# Altium project ESC.PrjPcb
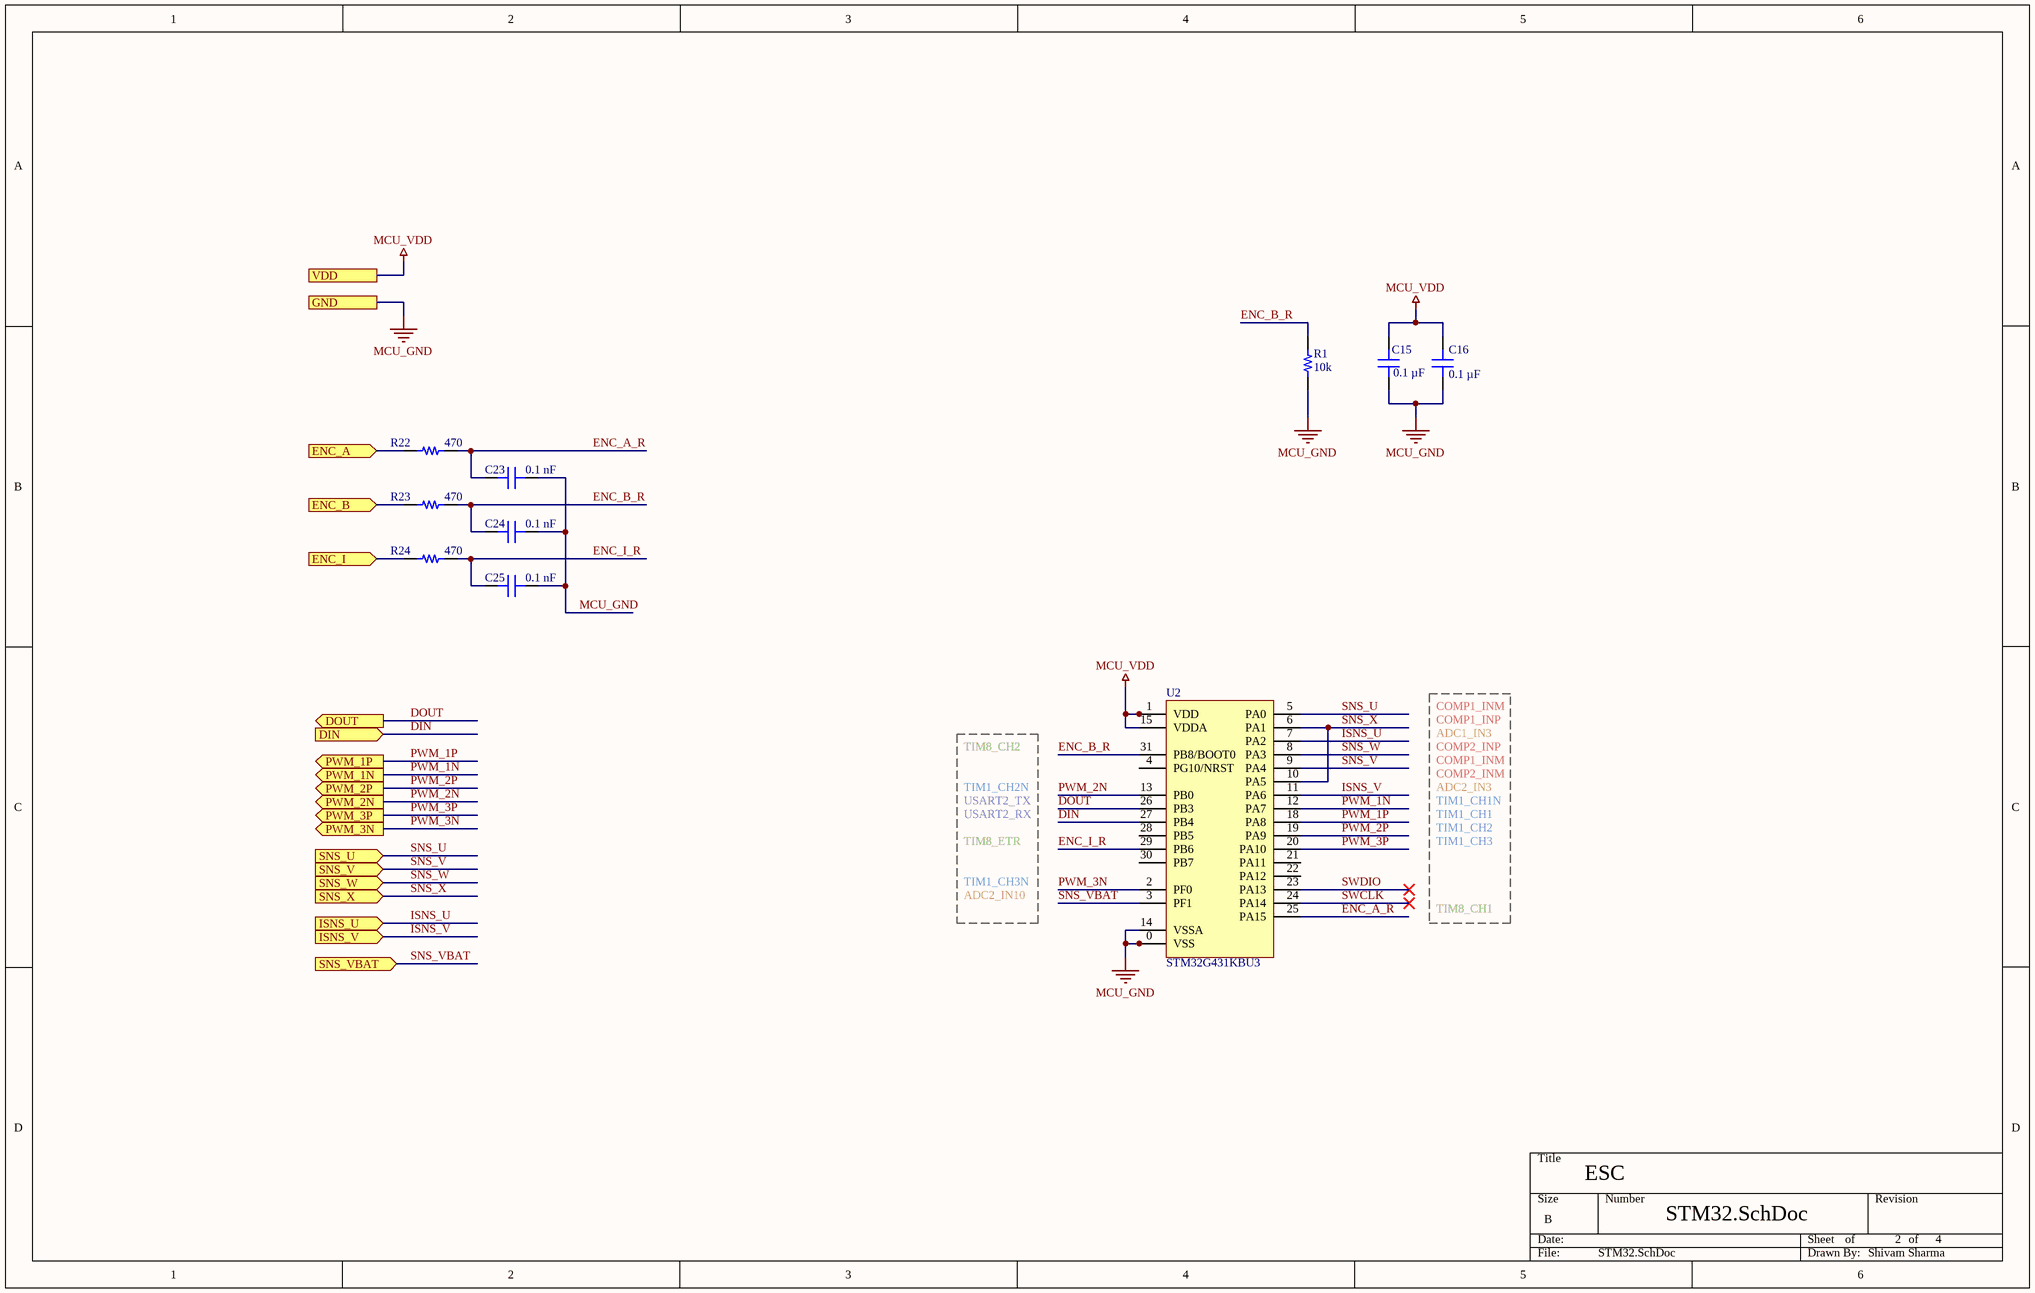
[diagram p0: STM32.SchDoc]
DrawnBy: Shivam Sharma; Project: ESC; Revision: 1.0
2 sheets, 14 parts. Net scope: strictly hierarchical (ports join the sheet entries above them; power ports are local).
Board file: ESC.PcbDoc
Sheets:
  STM32.SchDoc
  3V3_LDO.SchDoc

## Sheet STM32.SchDoc
size B; SheetNumber: 2; SheetTotal: 4

### Parts
C15  0.1 µF  [CAP 0402_1005]
C16  0.1 µF  [CAP 0402_1005]
C23  0.1 nF  [CAP 0402_1005]
C24  0.1 nF  [CAP 0402_1005]
C25  0.1 nF  [CAP 0402_1005]
R1  10k  [RES 0402_1005]
R22  470  [RES 0402_1005]
R23  470  [RES 0402_1005]
R24  470  [RES 0402_1005]
U2  STM32G431KBU3  [QFN50P400X400X60-32N]

### Ports
DIN (in), DOUT (out), ENC_A (in), ENC_B (in), ENC_I (in), GND, ISNS_U (in), ISNS_V (in), PWM_1N (out), PWM_1P (out), PWM_2N (out), PWM_2P (out), PWM_3N (out), PWM_3P (out), SNS_U (in), SNS_V (in), SNS_VBAT (in), SNS_W (in), SNS_X (in), VDD

### Nets
MCU_GND: C15.1 C16.1 C23.2 C24.2 C25.2 R1.1 U2.0(VSS) U2.14(VSSA) U2.16(VSS) U2.32(VSS) ; port GND
MCU_VDD: C15.2 C16.2 U2.1(VDD) U2.15(VDDA) U2.17(VDD) ; port VDD
DIN: U2.27(PB4) ; port DIN
DOUT: U2.26(PB3) ; port DOUT
ENC_A: R22.1 ; port ENC_A
ENC_A_R: C23.1 R22.2 U2.25(PA15)
ENC_B: R23.1 ; port ENC_B
ENC_B_R: C24.1 R1.2 R23.2 U2.31(PB8/BOOT0)
ENC_I: R24.1 ; port ENC_I
ENC_I_R: C25.1 R24.2 U2.29(PB6)
ISNS_U: U2.7(PA2) ; port ISNS_U
ISNS_V: U2.11(PA6) ; port ISNS_V
PWM_1N: U2.12(PA7) ; port PWM_1N
PWM_1P: U2.18(PA8) ; port PWM_1P
PWM_2N: U2.13(PB0) ; port PWM_2N
PWM_2P: U2.19(PA9) ; port PWM_2P
PWM_3N: U2.2(PF0) ; port PWM_3N
PWM_3P: U2.20(PA10) ; port PWM_3P
SNS_U: U2.5(PA0) ; port SNS_U
SNS_V: U2.9(PA4) ; port SNS_V
SNS_VBAT: U2.3(PF1) ; port SNS_VBAT
SNS_W: U2.8(PA3) ; port SNS_W
SNS_X: U2.6(PA1) U2.10(PA5) ; port SNS_X
SWCLK: U2.24(PA14)
SWDIO: U2.23(PA13)

Not connected (* = marked no-connect by the designer): U2 4(PG10/NRST) 21(PA11) 22(PA12) 28(PB5) 30(PB7)

### Notes on the sheet
- TIM8_CH2
- COMP1_INM
- COMP1_INP
- ADC1_IN3
- COMP2_INP
- COMP2_INM
- TIM1_CH2N
- USART2_TX
- USART2_RX
- ADC2_IN3
- TIM1_CH1N
- TIM1_CH1
- TIM1_CH2
- TIM1_CH3N
- TIM8_ETR
- ADC2_IN10
- TIM1_CH3
- TIM8_CH1
- of

### Library data of the parts
C15 C16 = C0402C104K4RACAUTO: CAP CER 0.1UF 16V X7R 0402; manufacturer: KEMET; Tolerance: ±10%; Part Number: C0402C104K4RACAUTO; Value: 0.1 µF; Applications: Automotive, Bypass, Decoupling; Capacitance: 0.1 µF; componentlink1description: Datasheet; componentlink1url: https://api.kemet.com/component-edge/download/specsheet/C0402C104K4RACAUTO.pdf; componentlink2description: DigiKey Link; componentlink2url: https://www.digikey.com/en/products/detail/kemet/C0402C104K4RACAUTO/3314827; Device Package: 0402 (1005 Metric); lastupdated: 8/14/2022 9:05:51 PM; Lifecycle Status: Active; Minimum Order: 1; Mounting Type: Surface Mount, MLCC; Operating Temperature: -55°C ~ 125°C; Package / Case: 0402 (1005 Metric); packaging: TapeAndReel; partid: 3024; Part Status: Active; price: 0.01; Ratings: AEC-Q200; series: SMD Auto X7R; Size / Dimension: 0.039" L x 0.020" W (1.00mm x 0.50mm); Supplier 1: DigiKey; Supplier Part Number 1: 399-6828-1-ND; Temperature Coefficient: X7R; Thickness (Max): 0.022" (0.55mm); Voltage - Rated: 16V
C23-C25 = C0402C104K4RACAUTO: CAP CER 0.1UF 16V X7R 0402; manufacturer: KEMET; Capacitance: 0.1 µF; Tolerance: ±10%; Part Number: C0402C104K4RACAUTO; Value: 0.1 nF; Applications: Automotive, Bypass, Decoupling; componentlink1description: Datasheet; componentlink1url: https://api.kemet.com/component-edge/download/specsheet/C0402C104K4RACAUTO.pdf; componentlink2description: DigiKey Link; componentlink2url: https://www.digikey.com/en/products/detail/kemet/C0402C104K4RACAUTO/3314827; Device Package: 0402 (1005 Metric); lastupdated: 8/14/2022 9:05:51 PM; Lifecycle Status: Active; Minimum Order: 1; Mounting Type: Surface Mount, MLCC; Operating Temperature: -55°C ~ 125°C; Package / Case: 0402 (1005 Metric); packaging: TapeAndReel; partid: 3024; Part Status: Active; price: 0.01; Ratings: AEC-Q200; series: SMD Auto X7R; Size / Dimension: 0.039" L x 0.020" W (1.00mm x 0.50mm); Supplier 1: DigiKey; Supplier Part Number 1: 399-6828-1-ND; Temperature Coefficient: X7R; Thickness (Max): 0.022" (0.55mm); Voltage - Rated: 16V
R1 R22-R24 = RK73H1ETTP1432F: RES 14.3K OHM 1% 1/10W 0402; Manufacturer: KOA Speer Electronics, Inc.; Power (Watts): 0.1W, 1/10W; Resistance: 14.3 kOhms; Temperature Coefficient: ±100ppm/°C; Part Number: RK73H1ETTP1432F; ComponentLink1Description: Datasheet; ComponentLink1URL: http://www.koaspeer.com/catimages/Products/RK73H/RK73H.pdf; ComponentLink2Description: DigiKey Link; ComponentLink2URL: https://www.digikey.com/en/products/detail/koa-speer-electronics-inc/RK73H1ETTP1432F/9844351; Composition: Thick Film; Device Package: 0402 (1005 Metric); Features: Automotive AEC-Q200, Moisture Resistant; Height - Seated (Max): 0.016" (0.40mm); LastUpdated: 8/14/2022 9:23:49 PM; Lifecycle Status: Active; Minimum Order: 1; Number of Terminations: 2; Operating Temperature: -55°C ~ 155°C; Package / Case: 0402 (1005 Metric); Packaging: CutTape; PartId: 10193; Part Status: Active; Price: 0.01; Ratings: AEC-Q200; Series: RK73H; Size / Dimension: 0.039" L x 0.020" W (1.00mm x 0.50mm); Supplier 1: DigiKey; Supplier Part Number 1: 2019-RK73H1ETTP1432FCT-ND; Supplier Device Package: 0402; Tolerance: ±1%
  R1: Value: 10k
  R22-R24: Value: 470
U2 = STM32G431KBU3: MCU UFQFPN-32

## Sheet 3V3_LDO.SchDoc
size B; SheetNumber: 4; SheetTotal: 4
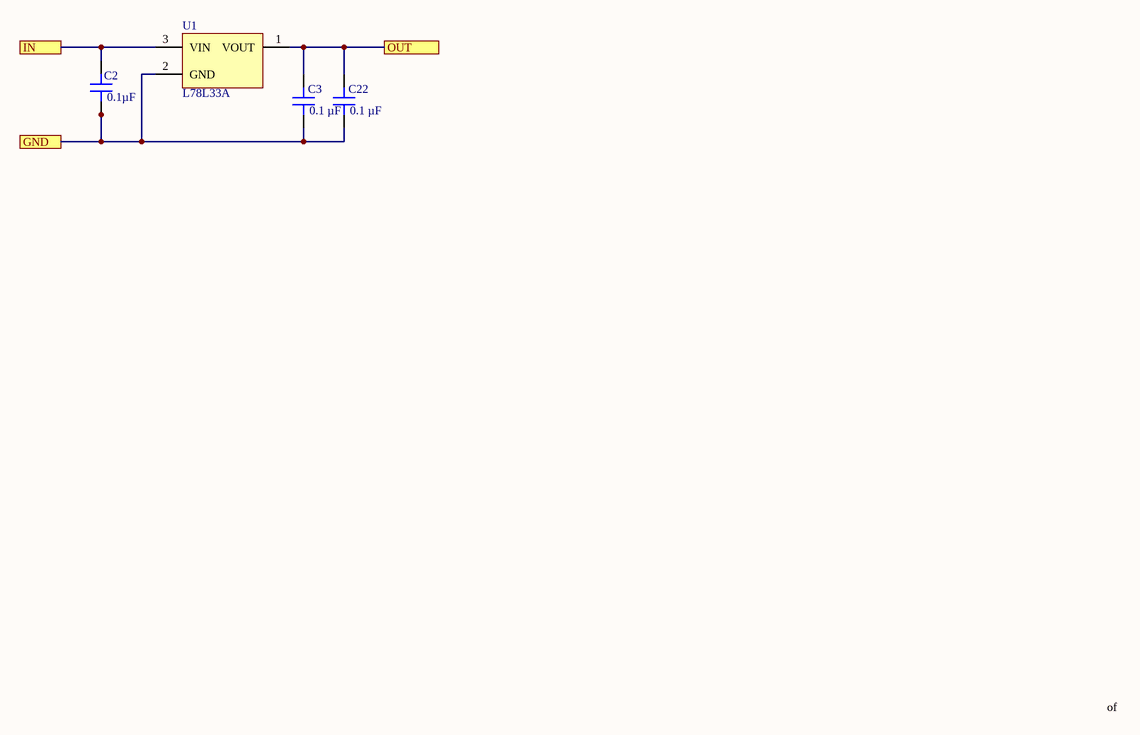
[diagram p1: 3V3_LDO.SchDoc]

### Parts
C2  0.1µF  [CAP 0603_1608]
C3  0.1 µF  [CAP 0402_1005]
C22  0.1 µF  [CAP 0402_1005]
U1  L78L33A  [SOT-89-3]

### Ports
GND, IN, OUT

### Nets
GND: C2.2 C3.1 C22.1 U1.2(GND) ; port GND
IN: C2.1 U1.3(VIN) ; port IN
OUT: C3.2 C22.2 U1.1(VOUT) ; port OUT

### Notes on the sheet
- of

### Library data of the parts
C2 = GCG188R92A104KA03D: CAP CER 0.1UF 100V 0603 EPOXY; Manufacturer: Murata Electronics; Temperature Coefficient: X8R; Tolerance: ±10%; Part Number: GCG188R92A104KA03D; Value: 0.1µF; Applications: Automotive; Capacitance: 0.1µF; ComponentLink1Description: Datasheet; ComponentLink1URL: https://search.murata.co.jp/Ceramy/image/img/A01X/G101/ENG/GCG188R92A104KA03-01.pdf; ComponentLink2Description: DigiKey Link; ComponentLink2URL: http://digikey.com/product-detail/en/murata-electronics/GCG188R92A104KA03D/490-18197-1-ND/9867926; Device Package: 0603 (1608 Metric); Features: Epoxy Mountable; LastUpdated: 21-Jan-20 12:01:59 AM; Lifecycle Status: Active; Minimum Order: 1; Mounting Type: Surface Mount, MLCC, Epoxy; Operating Temperature: -55°C ~ 150°C; Package / Case: 0603 (1608 Metric); Packaging: TapeAndReel; PartId: 9025; Part Status: Active; Price: 0.07; Ratings: AEC-Q200; Series: GCG; Size / Dimension: 0.063" L x 0.031" W (1.60mm x 0.80mm); Supplier 1: DigiKey; Supplier Part Number 1: 490-18197-1-ND; Thickness (Max): 0.035" (0.90mm); Voltage - Rated: 100V
C3 C22 = C0402C104K4RACAUTO: as C15 on sheet STM32; Part Number: C0402C104K4RACAUTO; Value: 0.1 µF; Applications: Automotive, Bypass, Decoupling; Capacitance: 0.1 µF; componentlink1description: Datasheet; componentlink1url: https://api.kemet.com/component-edge/download/specsheet/C0402C104K4RACAUTO.pdf; componentlink2description: DigiKey Link; componentlink2url: https://www.digikey.com/en/products/detail/kemet/C0402C104K4RACAUTO/3314827; Device Package: 0402 (1005 Metric); lastupdated: 8/14/2022 9:05:51 PM; Lifecycle Status: Active; Minimum Order: 1; Mounting Type: Surface Mount, MLCC; Operating Temperature: -55°C ~ 125°C; Package / Case: 0402 (1005 Metric); packaging: TapeAndReel; partid: 3024; Part Status: Active; price: 0.01; Ratings: AEC-Q200; series: SMD Auto X7R; Size / Dimension: 0.039" L x 0.020" W (1.00mm x 0.50mm); Supplier 1: DigiKey; Supplier Part Number 1: 399-6828-1-ND; Temperature Coefficient: X7R; Thickness (Max): 0.022" (0.55mm); Voltage - Rated: 16V
U1 = L78L33A: 3.3V LDO

## Assembly variants
Main: all parts fitted